# EAGLE board pic32ak_fe (EAGLE 9.6.2)
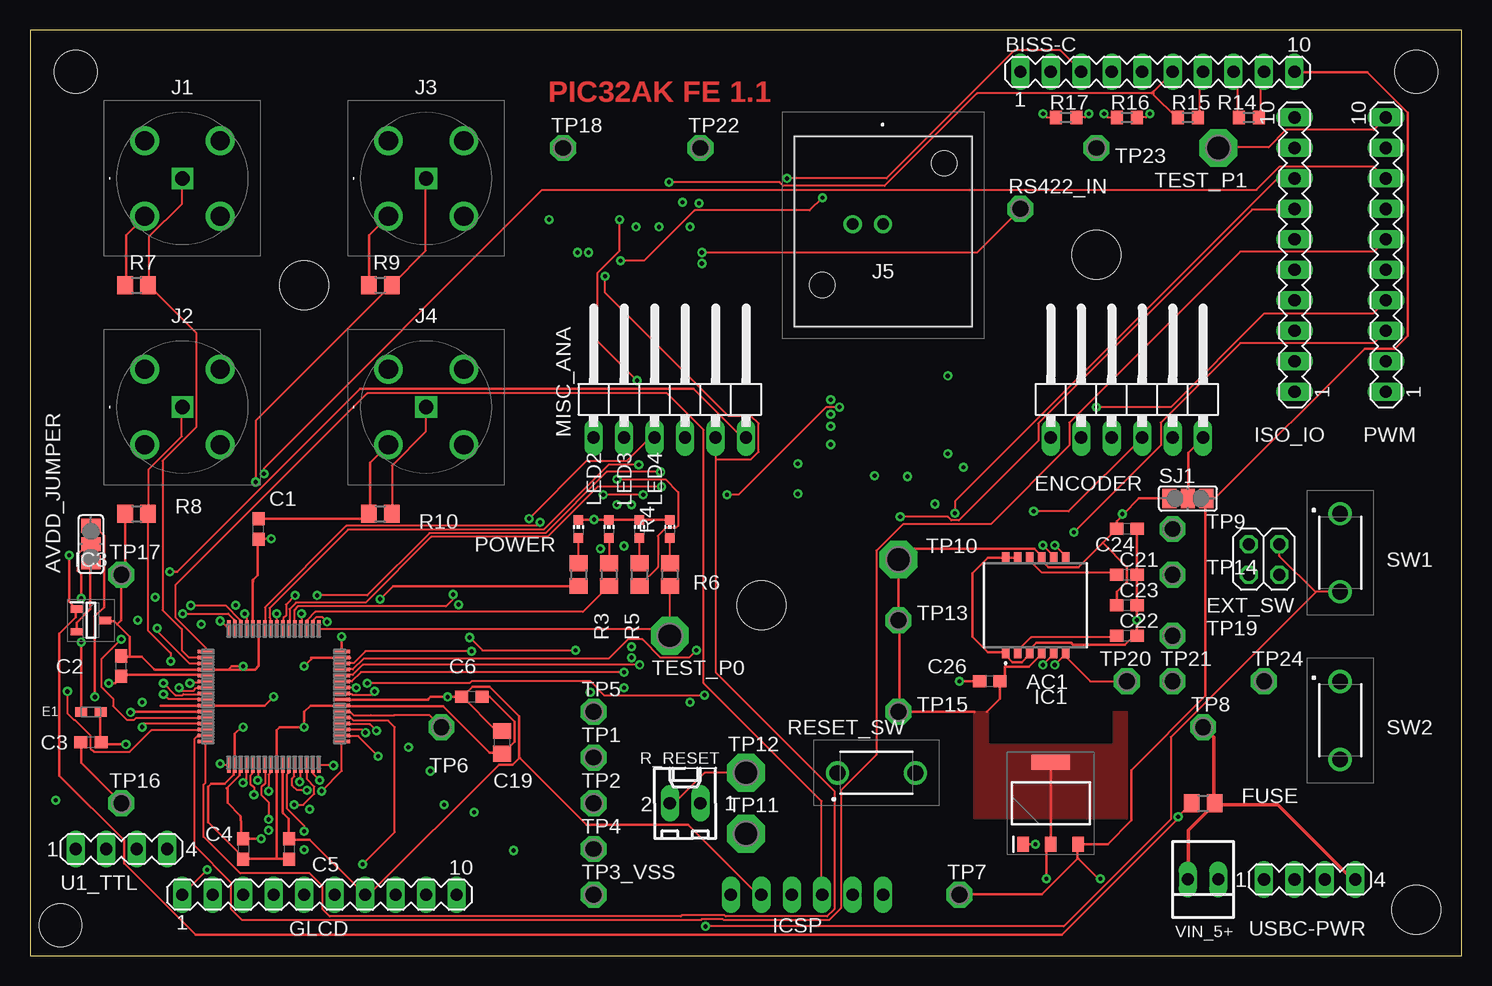
[diagram p1: board, top side]
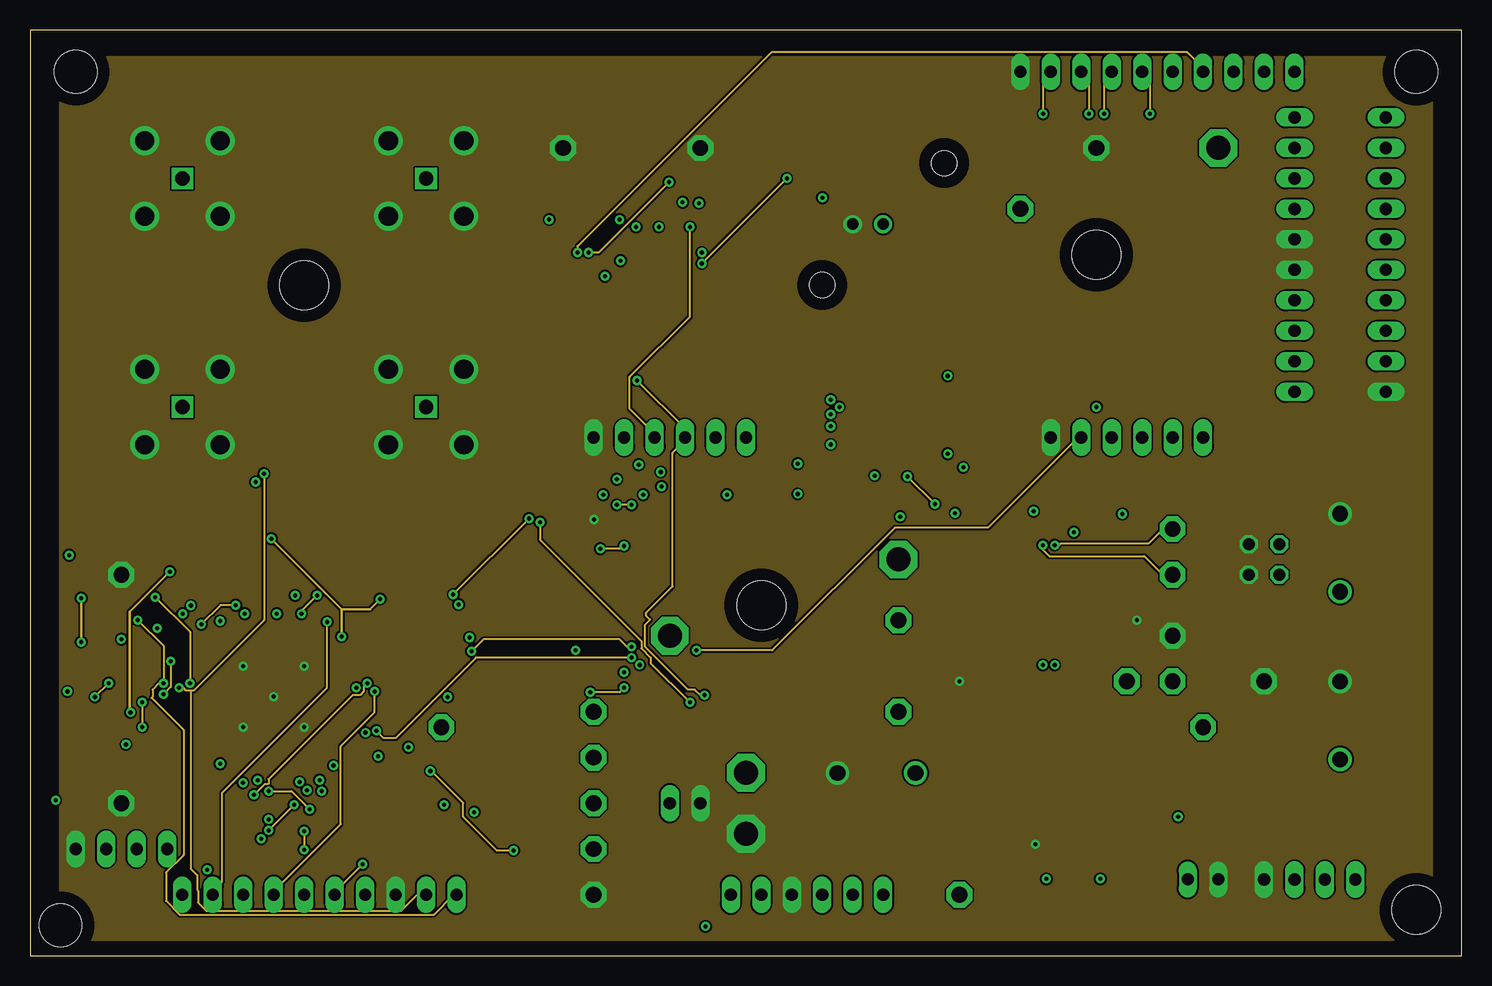
[diagram p2: board, inner layer Route2]
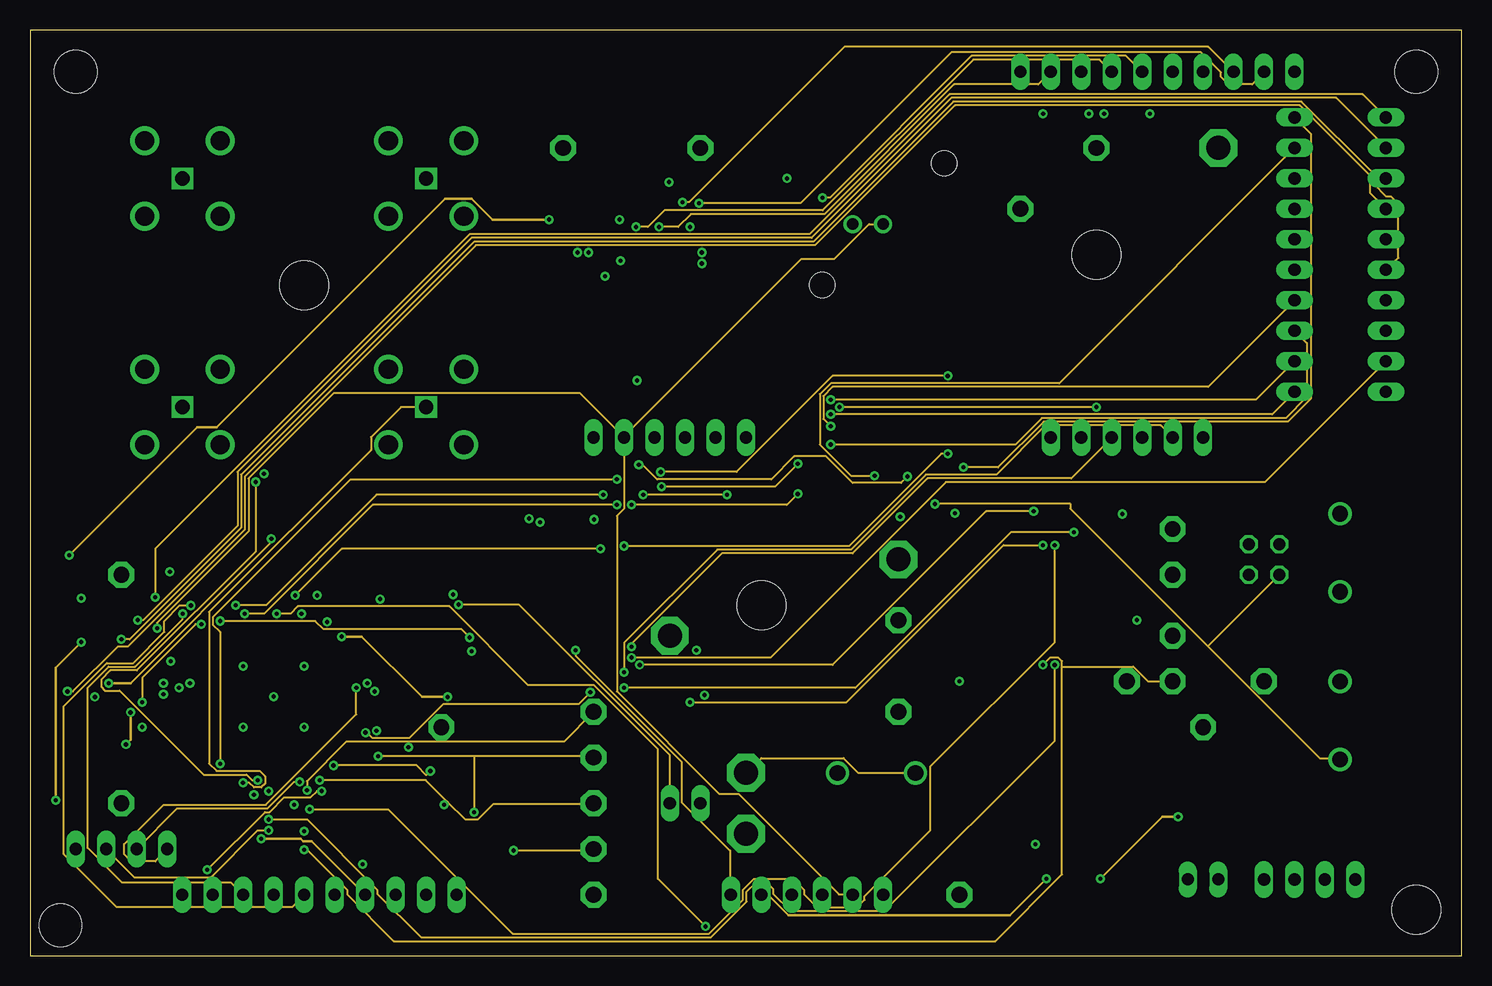
[diagram p3: board, inner layer Route15]
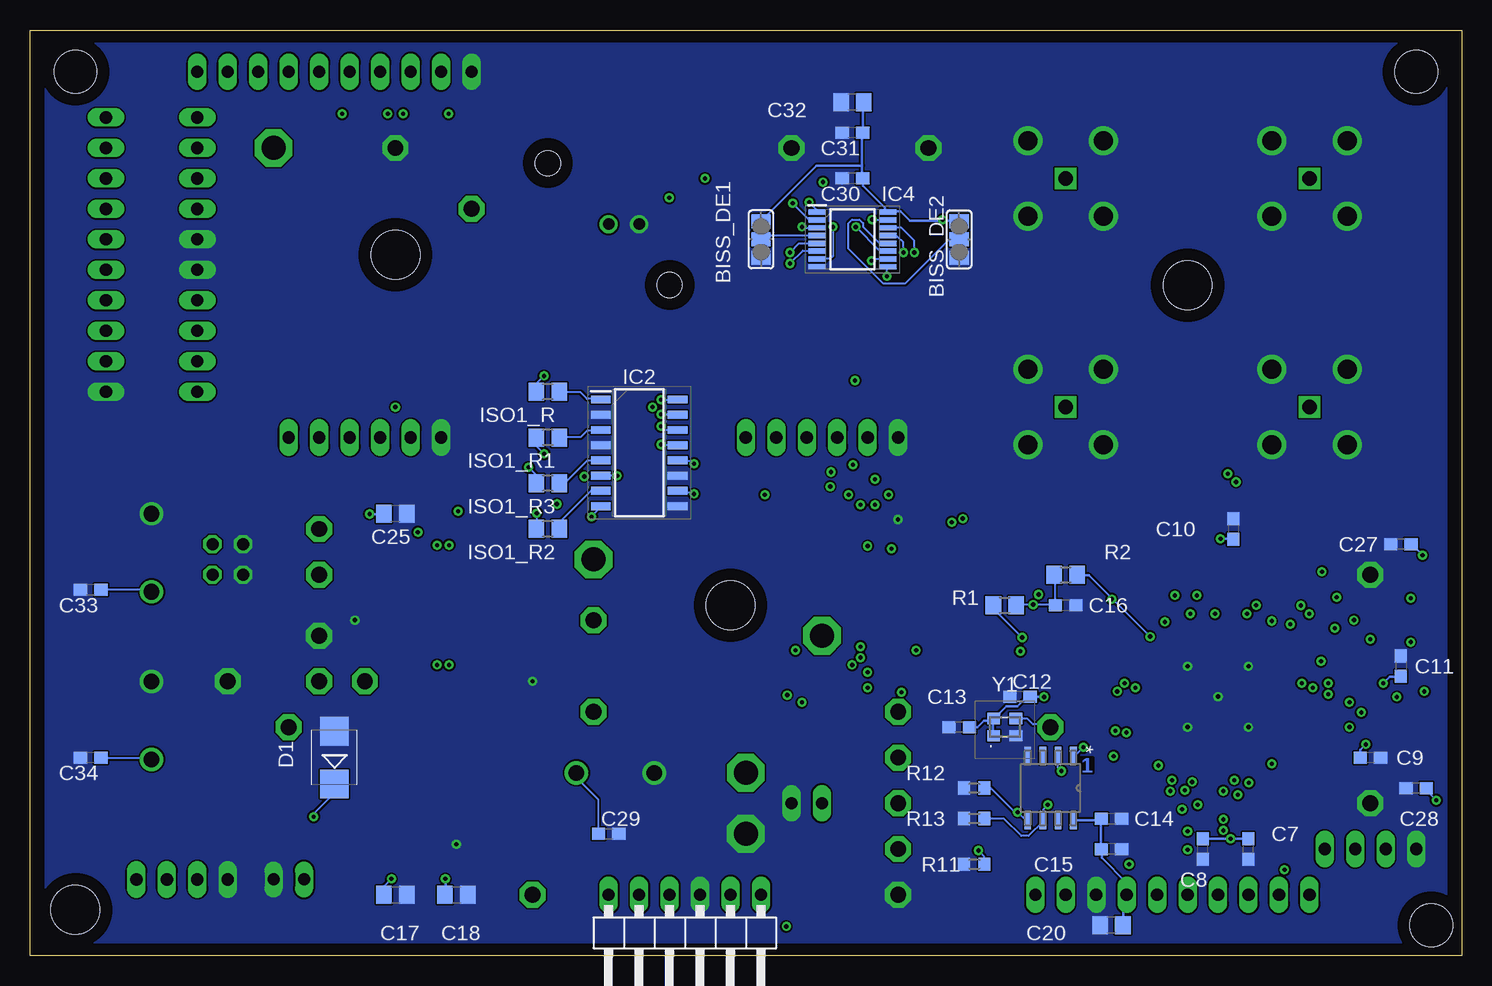
[diagram p4: board, bottom side, seen from below]

Size 119.36 x 77.14 mm. Coordinates in mm from the lower left corner, seen from the top.
Outline: 0,0 119.36,0 119.36,77.14 0,77.14 0,0
Copper layers (1+2*15+16): Top 0.035mm / dielectric 1.5mm / Route2 0.035mm / dielectric 0.15mm / Route15 0.035mm / dielectric 0.2mm / Bottom 0.035mm
Design rules "default *": minimum track width 6mil, minimum drill 0.35mm, track to track 6mil, track to pad 6mil, pad to pad 6mil, via to via 6mil, smd to smd 6mil, copper to edge 40mil, drill to drill 6mil, minimum pad ring 10mil, minimum via ring 8mil, stop-mask expansion 4mil, vias tented up to drill 0mil, thermal gap 10mil
Net classes: 1 current: width 0.203 mm; 2 high_current: width 0.305 mm
Holes 4.06 mm at 22.86,55.88 115.57,3.81 60.96,29.21 88.9,58.42
Holes 3.56 mm at 2.54,2.54 3.81,73.66 115.57,73.66
tRestrict: area 15.2,16.5 to 25.4,26.7; area 78.7,26.7 to 88.9,31.8; area 80,17.8 to 90.2,20.3
vRestrict: area 80,26.7 to 87.6,31.8

## Footprints (pad centres in the part's own frame; a part is rotated, then mirrored left to right if it is on the bottom)
SCA3300 = smd 0.61 x 0.98: 1 -2.5,-3.935; 2 -1.5,-3.935; 3 -0.5,-3.935; 4 0.5,-3.935; 5 1.5,-3.935; 6 2.5,-3.935; 7 2.5,3.935; 8 1.5,3.935; 9 0.5,3.935; 10 -0.5,3.935; 11 -1.5,3.935; 12 -2.5,3.935
SJ_2 = smd 1.168 x 1.6: 1 -1.524,0; 2 0,0; 3 1.524,0
MA10-1 = drill 1.016 long: 1 -11.43,0; 2 -8.89,0; 3 -6.35,0; 4 -3.81,0; 5 -1.27,0; 6 1.27,0; 7 3.81,0; 8 6.35,0; 9 8.89,0; 10 11.43,0
C0603 = smd 1.1 x 1: 1 -0.85,0; 2 0.85,0
C0805 = smd 1.3 x 1.5: 1 -0.95,0; 2 0.95,0
SMB = smd 2.4 x 2.4: A 2.2,0; C -2.2,0
FB_LI0603G121R-10 = smd 1 x 0.8: 1 -0.8,0; 2 0.8,0
1X06/90 = drill 1.016 long: 1 -6.35,-3.81; 2 -3.81,-3.81; 3 -1.27,-3.81; 4 1.27,-3.81; 5 3.81,-3.81; 6 6.35,-3.81
2X02 = drill 1.016 octagon: 1 -1.27,-1.27; 2 -1.27,1.27; 3 1.27,-1.27; 4 1.27,1.27
R0805 = smd 1.3 x 1.5: 1 -0.95,0; 2 0.95,0
SOT230P700X180-4N = smd 1.25 x 0.95: 1 -3.4,2.3; 2 -3.4,0; 3 -3.4,-2.3 | smd 1.25 x 3.2: 4 3.4,0
SOIC127P700X230-16N = smd 1.65 x 0.65: 1 -3.2,4.445; 2 -3.2,3.175; 3 -3.2,1.905; 4 -3.2,0.635; 5 -3.2,-0.635; 6 -3.2,-1.905; 7 -3.2,-3.175; 8 -3.2,-4.445; 9 3.2,-4.445; 10 3.2,-3.175; 11 3.2,-1.905; 12 3.2,-0.635; 13 3.2,0.635; 14 3.2,1.905; 15 3.2,3.175; 16 3.2,4.445
SOT96P237X111-3N = smd 1 x 0.6: 1 -1.2,0.955; 2 -1.2,-0.955; 3 1.2,0
SOP65P640X120-16N = smd 1.475 x 0.45: 1 -2.938,2.275; 2 -2.938,1.625; 3 -2.938,0.975; 4 -2.938,0.325; 5 -2.938,-0.325; 6 -2.938,-0.975; 7 -2.938,-1.625; 8 -2.938,-2.275; 9 2.938,-2.275; 10 2.938,-1.625; 11 2.938,-0.975; 12 2.938,-0.325; 13 2.938,0.325; 14 2.938,0.975; 15 2.938,1.625; 16 2.938,2.275
CONBNC001 = drill 1.2 pad 1.8 square: 1 0,0 | drill 1.6 pad 2.4: 2 -3.15,3.15; 3 -3.15,-3.15; 4 3.15,-3.15; 5 3.15,3.15
52272223 = drill 0.97 pad 1.509: 1 0,0; 2 -2.54,0 | hole 2.09: 5.08,5.08; -5.08,-5.08
CHIP-LED0603 = smd 0.8 x 0.8: A 0,-0.75; C 0,0.75
R0603 = smd 1 x 1.1: 1 -0.85,0; 2 0.85,0
6410-02 = drill 1.016 long: 1 1.27,0; 2 -1.27,0
PTS635SL50LFS = drill 1.3 pad 1.95: 1 0,0; 2 6.5,0
P1-13 = drill 1.321 pad 2.159 octagon: TP 0,0
P1-20 = drill 2.007 pad 3.15 octagon: TP 0,0
TQFP64_PT_MCH = smd 1.346 x 0.279: 1 -5.677,3.75; 2 -5.677,3.25; 3 -5.677,2.75; 4 -5.677,2.25; 5 -5.677,1.75; 6 -5.677,1.25; 7 -5.677,0.75; 8 -5.677,0.25; 9 -5.677,-0.25; 10 -5.677,-0.75; 11 -5.677,-1.25; 12 -5.677,-1.75; 13 -5.677,-2.25; 14 -5.677,-2.75; 15 -5.677,-3.25; 16 -5.677,-3.75; 33 5.677,-3.75; 34 5.677,-3.25; 35 5.677,-2.75; 36 5.677,-2.25; 37 5.677,-1.75; 38 5.677,-1.25; 39 5.677,-0.75; 40 5.677,-0.25; 41 5.677,0.25; 42 5.677,0.75; 43 5.677,1.25; 44 5.677,1.75; 45 5.677,2.25; 46 5.677,2.75; 47 5.677,3.25; 48 5.677,3.75 | smd 0.279 x 1.346: 17 -3.75,-5.677; 18 -3.25,-5.677; 19 -2.75,-5.677; 20 -2.25,-5.677; 21 -1.75,-5.677; 22 -1.25,-5.677; 23 -0.75,-5.677; 24 -0.25,-5.677; 25 0.25,-5.677; 26 0.75,-5.677; 27 1.25,-5.677; 28 1.75,-5.677; 29 2.25,-5.677; 30 2.75,-5.677; 31 3.25,-5.677; 32 3.75,-5.677; 49 3.75,5.677; 50 3.25,5.677; 51 2.75,5.677; 52 2.25,5.677; 53 1.75,5.677; 54 1.25,5.677; 55 0.75,5.677; 56 0.25,5.677; 57 -0.25,5.677; 58 -0.75,5.677; 59 -1.25,5.677; 60 -1.75,5.677; 61 -2.25,5.677; 62 -2.75,5.677; 63 -3.25,5.677; 64 -3.75,5.677
MA04-1 = drill 1.016 long: 1 -3.81,0; 2 -1.27,0; 3 1.27,0; 4 3.81,0
SOIC8_150MIL_N_ISI = smd 1.46 x 0.559: 1 -2.724,1.905; 2 -2.724,0.635; 3 -2.724,-0.635; 4 -2.724,-1.905; 5 2.724,-1.905; 6 2.724,-0.635; 7 2.724,0.635; 8 2.724,1.905
22-23-2021 = drill 1 long: 1 -1.27,0; 2 1.27,0
KC2520Z800000C1KX00 = smd 1.05 x 0.95: 1 -0.925,-0.725; 2 0.925,-0.725; 3 0.925,0.725; 4 -0.925,0.725

## Placement (x,y rotation side)
AC1  SCA3300-D01-1  [SCA3300]  83.82,29.21 0 top
AVDD_JUMPER  AVDD JUMPER  [SJ_2]  5.08,34.29 90 top
BISS-C  BISS-C  [MA10-1]  93.98,73.66 0 top
BISS_DE1  BISS_DE1  [SJ_2]  58.42,59.69 90 bottom
BISS_DE2  BISS_DE2  [SJ_2]  41.91,59.69 270 bottom
C1  1000pf  [C0603]  19.05,35.56 90 top
C2  1000pf  [C0603]  7.62,24.13 90 top
C3  1000pf  [C0603]  5.08,17.78 180 top
C4  1000pf  [C0603]  17.78,8.89 270 top
C5  1000pf  [C0603]  21.59,8.89 270 top
C6  1000pf  [C0603]  36.83,21.59 0 top
C7  0.1uf  [C0603]  17.78,8.89 90 bottom
C8  0.1uf  [C0603]  21.59,8.89 90 bottom
C9  0.1uf  [C0603]  7.62,16.51 180 bottom
C10  0.1uf  [C0603]  19.05,35.56 270 bottom
C11  0.1uf  [C0603]  5.08,24.13 270 bottom
C12  0.1uf  [C0603]  36.83,21.59 0 bottom
C13  0.1uf  [C0603]  41.91,19.05 180 bottom
C14  1000pf  [C0603]  29.21,11.43 0 bottom
C15  0.1uf  [C0603]  29.21,8.89 180 bottom
C16  1000pf  [C0603]  33.02,29.21 0 bottom
C17  10uf  [C0805]  88.9,5.08 0 bottom
C18  10uf  [C0805]  83.82,5.08 0 bottom
C19  10uf  [C0805]  39.37,17.78 90 top
C20  10uf  [C0805]  29.21,2.54 180 bottom
C21  0.1uf  [C0603]  91.44,31.75 0 top
C22  0.1uf  [C0603]  91.44,26.67 0 top
C23  1000pf  [C0603]  91.44,29.21 0 top
C24  0.1uf  [C0603]  91.44,35.56 180 top
C25  10uf  [C0805]  88.9,36.83 180 bottom
C26  0.1uf  [C0603]  80.01,22.86 180 top
C27  0.1uf  [C0603]  5.08,34.29 180 bottom
C28  0.1uf  [C0603]  3.81,13.97 180 bottom
C29  0.1uf  [C0603]  71.12,10.16 0 bottom
C30  0.1uf  [C0603]  50.8,64.77 180 bottom
C31  1000pf  [C0603]  50.8,68.58 180 bottom
C32  10uf  [C0805]  50.8,71.12 180 bottom
C33  0.1uf  [C0603]  114.3,30.48 180 bottom
C34  0.1uf  [C0603]  114.3,16.51 180 bottom
D1  5.6V  [SMB]  93.98,16.51 90 bottom
E1  LI0603G121R-10  [FB_LI0603G121R-10]  5.08,20.32 0 top
ENCODER  Encoder  [1X06/90]  91.44,46.99 0 top
EXT_SW  EXT_SW  [2X02]  102.87,33.02 180 top
FUSE  0 ohm  [R0805]  97.79,12.7 0 top
GLCD  GLCD  [MA10-1]  24.13,5.08 0 top
IC1  NCP1117LPST33T3G  [SOT230P700X180-4N]  85.09,12.7 90 top
IC2  SFH6916  [SOIC127P700X230-16N]  68.58,41.91 0 bottom
IC3  NCP51460SN33T1G  [SOT96P237X111-3N]  5.08,27.94 0 top
IC4  SN65C1168EPWR  [SOP65P640X120-16N]  50.8,59.69 0 bottom
ICSP  ICSP  [1X06/90]  64.77,1.27 180 bottom
ISO1_R  330 ohm  [R0805]  76.2,46.99 180 bottom
ISO1_R1  330 ohm  [R0805]  76.2,43.18 180 bottom
ISO1_R2  2.2k ohm  [R0805]  76.2,35.56 180 bottom
ISO1_R3  2.2k ohm  [R0805]  76.2,39.37 180 bottom
ISO_IO  ISO_IO  [MA10-1]  105.41,58.42 90 top
J1  CONBNC001  [CONBNC001]  12.7,64.77 0 top
J2  CONBNC001  [CONBNC001]  12.7,45.72 0 top
J3  CONBNC001  [CONBNC001]  33.02,64.77 0 top
J4  CONBNC001  [CONBNC001]  33.02,45.72 0 top
J5  5227222-3  [52272223]  71.12,60.96 0 top
LED2  rled  [CHIP-LED0603]  48.26,35.56 0 top
LED3  dled  [CHIP-LED0603]  50.8,35.56 0 top
LED4  hled  [CHIP-LED0603]  53.34,35.56 0 top
MISC_ANA  MISC_ANA  [1X06/90]  53.34,46.99 0 top
POWER  POWER  [CHIP-LED0603]  45.72,35.56 0 top
PWM  PWM  [MA10-1]  113.03,58.42 90 top
R1  56 ohm  [R0805]  38.1,29.21 0 bottom
R2  10K ohm  [R0805]  33.02,31.75 0 bottom
R3  2.2K ohm  [R0805]  45.72,31.75 270 top
R4  2.2K ohm  [R0805]  48.26,31.75 270 top
R5  2.2K ohm  [R0805]  50.8,31.75 270 top
R6  2.2K ohm  [R0805]  53.34,31.75 270 top
R7  50 ohm  [R0805]  8.89,55.88 0 top
R8  50 ohm  [R0805]  8.89,36.83 0 top
R9  50 ohm  [R0805]  29.21,55.88 0 top
R10  50 ohm  [R0805]  29.21,36.83 0 top
R11  120 ohm  [R0603]  40.64,7.62 0 bottom
R12  50 ohm  [R0603]  40.64,13.97 0 bottom
R13  50 ohm  [R0603]  40.64,11.43 0 bottom
R14  120 ohm  [R0603]  101.6,69.85 180 top
R15  120 ohm  [R0603]  96.52,69.85 180 top
R16  120 ohm  [R0603]  91.44,69.85 180 top
R17  120 ohm  [R0603]  86.36,69.85 180 top
R_RESET  22-27-2021-02  [6410-02]  54.61,12.7 0 top
RESET_SW  PTS635SL50LFS  [PTS635SL50LFS]  67.31,15.24 0 top
RS422_IN  PTR1PAD1-13  [P1-13]  82.55,62.23 0 top
SJ1  QEI Voltage  [SJ_2]  96.52,38.1 0 top
SW1  PTS635SL50LFS  [PTS635SL50LFS]  109.22,36.83 270 top
SW2  PTS635SL50LFS  [PTS635SL50LFS]  109.22,22.86 270 top
TEST_P0  PTR1PAD1-20  [P1-20]  53.34,26.67 0 top
TEST_P1  PTR1PAD1-20  [P1-20]  99.06,67.31 0 top
TP1  PTR1PAD1-13  [P1-13]  46.99,16.51 0 top
TP2  PTR1PAD1-13  [P1-13]  46.99,12.7 0 top
TP3_VSS  PTR1PAD1-13  [P1-13]  46.99,5.08 0 top
TP4  PTR1PAD1-13  [P1-13]  46.99,8.89 0 top
TP5  PTR1PAD1-13  [P1-13]  46.99,20.32 0 top
TP6  PTR1PAD1-13  [P1-13]  34.29,19.05 0 top
TP7  PTR1PAD1-13  [P1-13]  77.47,5.08 0 top
TP8  PTR1PAD1-13  [P1-13]  97.79,19.05 0 top
TP9  PTR1PAD1-13  [P1-13]  95.25,35.56 0 top
TP10  PTR1PAD1-20  [P1-20]  72.39,33.02 0 top
TP11  PTR1PAD1-20  [P1-20]  59.69,10.16 0 top
TP12  PTR1PAD1-20  [P1-20]  59.69,15.24 0 top
TP13  PTR1PAD1-13  [P1-13]  72.39,27.94 0 top
TP14  PTR1PAD1-13  [P1-13]  95.25,31.75 0 top
TP15  PTR1PAD1-13  [P1-13]  72.39,20.32 0 top
TP16  PTR1PAD1-13  [P1-13]  7.62,12.7 0 top
TP17  PTR1PAD1-13  [P1-13]  7.62,31.75 0 top
TP18  PTR1PAD1-13  [P1-13]  44.45,67.31 0 top
TP19  PTR1PAD1-13  [P1-13]  95.25,26.67 0 top
TP20  PTR1PAD1-13  [P1-13]  91.44,22.86 0 top
TP21  PTR1PAD1-13  [P1-13]  95.25,22.86 0 top
TP22  PTR1PAD1-13  [P1-13]  55.88,67.31 0 top
TP23  PTR1PAD1-13  [P1-13]  88.9,67.31 0 top
TP24  PTR1PAD1-13  [P1-13]  102.87,22.86 0 top
U1  PIC32AK1216GC41064-E/PT  [TQFP64_PT_MCH]  20.32,21.59 0 top
U1_TTL  U1_TTL  [MA04-1]  7.62,8.89 0 top
U2  IS66WVS4M8BLL-104NLI  [SOIC8_150MIL_N_ISI]  34.29,13.97 270 bottom
USBC-PWR  USBC-PWR  [MA04-1]  106.68,6.35 0 top
VIN_5+  22-23-2021  [22-23-2021]  97.79,6.35 180 top
Y1  KC2520Z8.00000C1KX00  [KC2520Z800000C1KX00]  38.1,19.05 0 bottom

## Tracks (layer width: path | path; a pad name or v marks a point on that pad's centre or on a via)
3.3REG
  Top 0.203: IC3.2 3.89,27.05 3.89,27.74 5.03,28.88 5.03,32.77 AVDD_JUMPER.1
8MHZ_CLK
  Top 0.152: U1.38 26.06,20.27 26.75,20.27 26.84,20.17 26.94,20.08 26.98,20.04 28.42,20.04 30.32,20.04 30.4,20.04 33.3,20.04 TP6.TP
  Bottom 0.152: TP6.TP 34.52,19.28 35.74,19.28 36.2,19.74 37.11,19.74 Y1.3
AD1AN6
  Top 0.152: U1.2 13.26,24.84 12.7,25.4 12.65,25.45 12.65,27.2 11.05,28.8 11.05,41.22 13.87,44.04 13.87,51.89 9.91,55.85 R7.2 9.91,55.93 9.91,59.89 12.65,62.64 12.65,64.77 J1.1
AD2AN7  (via drill 0.35)
  Top 0.152: v11.12,21.79 11.51,21.41 14.63,21.41 U1.9 | v11.73,24.54 11.73,25.22 9.83,27.13 9.83,36.8 R8.2 9.91,36.88 9.91,40.54 12.65,43.28 12.65,45.72 J2.1
  Route2 0.152: v11.12,21.79 11.73,22.4 v11.73,24.54
AVDD  (via drill 0.35)
  Top 0.203: 14.62,20.32 14.61,20.32 | 14.61,20.32 13.34,20.32 9.6,20.32 9.37,20.32 8.69,20.32 8.42,20.32 v8.38,20.27 | E1.2 5.87,20.27 5.87,17.83 C3.1 6.02,17.75 6.17,17.6 v8,17.6 | v11.66,32 12.27,32 27.51,47.24 55.32,47.24 59.36,43.2 59.66,43.2 MISC_ANA.6 | U1.11 14.61,20.32
  Route2 0.203: v11.66,32 8.31,28.65 8.31,20.34 v8.38,20.27
  Route15 0.203: v8.38,20.27 8.38,17.98 v8,17.6
  Bottom 0.203: v8,17.6 8.46,17.14 8.46,16.54 C9.2
AVDD_IN  (via drill 0.35)
  Top 0.203: v4.27,26.14 4.27,20.34 E1.1 | v4.27,29.79 4.27,31.77 3.96,32.08 3.96,33.45 4.8,34.29 AVDD_JUMPER.2
  Route2 0.203: v4.27,29.79 v4.27,26.14
  Route15 0.203: v2.13,12.95 2.13,24 v4.27,26.14
  Bottom 0.203: v2.13,12.95 2.9,13.72 2.9,13.95 C28.1
DIS_CS  (via drill 0.35)
  Top 0.152: v13.41,29.18 16.31,29.18 17.53,27.96 17.53,27.28 U1.62
  Route15 0.152: v13.41,29.18 12.5,29.18 11.2,27.89 11.2,26.98 8.61,24.38 6.4,24.38 2.82,20.8 2.82,8.46 7.24,4.04 21.87,4.04 22.86,5.03 GLCD.5
DIS_MODE  (via drill 0.35)
  Top 0.152: v28.73,22.02 28.42,21.72 26.9,21.72 26.82,21.79 26.06,21.79 U1.41
  Route2 0.152: v28.73,22.02 28.73,20.27 25.91,17.45 25.91,10.97 20.34,5.41 20.34,5.11 GLCD.4
DIS_RESET  (via drill 0.35)
  Top 0.152: v27.74,7.62 30.4,10.29 30.4,19.05 29.87,19.58 26.98,19.58 26.75,19.81 26.06,19.81 U1.37
  Route2 0.152: v27.74,7.62 25.45,5.33 25.45,5.11 GLCD.6
DLED  (via drill 0.35)
  Top 0.152: v15.85,16 15.93,15.93 16.54,15.93 U1.17 | v48.92,39.7 52.96,39.7 54.03,38.63 54.03,35.81 53.87,35.66 53.03,35.66 52.35,34.98 52.35,32.38 50.83,30.86 R5.2
  Route15 0.152: v15.85,16 15.85,26.98 15.24,27.58 15.24,28.19 26.75,39.7 v48.92,39.7
HLED
  Top 0.152: U1.49 24.08,27.2 52.81,27.2 TEST_P0.TP 52.88,27.2 53.34,27.66 R6.2
IMU_CS  (via drill 0.35)
  Top 0.152: v84.43,24.23 85.27,25.07 85.27,25.22 AC1.5 | v22.86,10.36 22.86,10.82 21.41,12.27 21.41,15.09 21.57,15.24 21.57,15.85 U1.27
  Route2 0.152: v22.86,10.36 v22.86,8.84
  Route15 0.152: v84.43,24.23 85.04,24.84 85.72,24.84 86.03,24.54 86.03,24.08 | 86.03,24.08 86.03,6.78 80.47,1.22 30.33,1.22 26.44,5.11 26.44,5.49 23.09,8.84 v22.86,8.84 | TP21.TP 93.19,22.86 91.97,24.08 86.03,24.08
IOS1_N  (via drill 0.35)
  Route15 0.152: v66.75,45.11 103.56,45.11 105.39,46.94 ISO_IO.1
  Bottom 0.152: v66.75,45.11 65.46,45.11 IC2.15
IOS1_P  (via drill 0.35)
  Route15 0.152: v66.75,46.33 102.18,46.33 105.39,49.53 ISO_IO.2
  Bottom 0.152: v66.75,46.33 65.46,46.33 IC2.16
IOS2_N  (via drill 0.35)
  Route15 0.152: v66.75,42.6 82.14,42.6 84.35,44.81 104.7,44.81 106.45,46.56 106.45,51.05 105.46,52.05 ISO_IO.3
  Bottom 0.152: v66.75,42.6 65.46,42.6 IC2.13
IOS3_O  (via drill 0.35)
  Top 0.152: v52.65,39.09 47.32,39.09 43.13,34.9 33.45,34.9 27.96,29.41 22.17,29.41 21.64,28.88 21.64,27.28 U1.54
  Route15 0.152: v52.65,39.09 62.1,39.09 v64.01,41
  Bottom 0.152: v64.01,41 64.24,41.22 65.38,41.22 IC2.12
IOS3_P  (via drill 0.35)
  Route15 0.152: v77.8,40.69 80.7,40.69 84.51,44.5 104.85,44.5 106.76,46.41 106.76,68.5 ISO_IO.10
  Bottom 0.152: v77.8,40.69 77.19,40.08 77.19,39.4 ISO1_R3.2
IOS4_O  (via drill 0.35)
  Top 0.152: v17.91,28.5 18.06,28.35 U1.61
  Route2 0.152: v50.14,37.57 v48.92,37.57
  Route15 0.152: v17.91,28.5 19.51,28.5 28.57,37.57 v48.92,37.57 | v50.14,37.57 63.09,37.57 v64.01,38.48
  Bottom 0.152: v64.01,38.48 64.16,38.63 65.3,38.63 65.38,38.71 IC2.10
ISO1_S  (via drill 0.35)
  Top 0.152: v22.63,28.5 22.63,27.28 U1.52 | v23.93,30.02 28.12,30.02 33.3,35.2 42.98,35.2 48.08,40.31 v52.58,40.31
  Route2 0.152: v22.63,28.5 22.63,28.73 v23.93,30.02
  Route15 0.152: v52.58,40.31 58.9,40.31 66.9,48.31 v76.5,48.31
  Bottom 0.152: v76.5,48.31 77.11,47.7 77.11,47.02 ISO1_R.2
ISO2_P  (via drill 0.35)
  Route15 0.152: v66.75,44.12 66.14,44.73 66.14,46.63 66.9,47.4 98.22,47.4 105.39,54.56 ISO_IO.4
  Bottom 0.152: IC2.14 66.45,43.81 v66.75,44.12
ISO2_S  (via drill 0.35)
  Top 0.152: v22.1,30.02 21.34,29.26 21.34,28.35 21.11,28.12 21.11,27.28 U1.55
  Route2 0.152: v47.55,33.91 49.3,33.91 v49.53,34.14
  Route15 0.152: v22.1,30.02 25.98,33.91 v47.55,33.91 | v49.53,34.14 68.28,34.14 75.97,41.83 v76.5,41.83
  Bottom 0.152: v76.5,41.83 77.11,42.44 77.11,43.13 ISO1_R1.2
ISO3_N  (via drill 0.35)
  Route15 0.152: v70.41,40.01 68.43,40.01 65.84,42.6 65.84,46.79 66.75,47.7 85.8,47.7 ISO_IO.9
  Bottom 0.152: v70.41,40.01 IC2.6
ISO4_N  (via drill 0.35)
  Top 0.152: v72.54,36.58 76.5,36.58 76.81,36.27 77.42,36.27 84.05,42.9 84.05,44.35 101.88,62.18 105.39,62.18 ISO_IO.7
  Bottom 0.152: v72.54,36.58 72.39,36.73 72.39,36.8 71.78,37.41 IC2.8
ISO4_P  (via drill 0.35)
  Top 0.152: v77.11,36.88 77.11,37.87 104.01,64.77 ISO_IO.8
  Bottom 0.152: v77.11,36.88 77.11,35.59 ISO1_R2.2
MA+  (via drill 0.35)
  Top 0.152: v53.26,64.47 62.48,64.47 62.79,64.16 71.25,64.16 78.94,71.86 93.5,71.86 93.69,72.05 | 93.69,72.05 95.25,73.61 BISS-C.6 | R15.2 95.57,69.85 93.66,71.75 93.66,72.07 93.69,72.05
  Route2 0.152: v46.56,58.6 47.4,58.6 v53.26,64.47
  Bottom 0.152: v46.56,58.6 46.56,59.44 47.09,59.97 47.85,59.97 IC4.13
MA-  (via drill 0.35)
  Top 0.152: BISS-C.7 97.47,73.34 97.47,69.85 R15.1
  Route2 0.152: v45.64,58.6 45.64,59.13 61.8,75.29 96.47,75.29 97.77,73.99 97.77,73.69 BISS-C.7
  Bottom 0.152: v45.64,58.6 45.64,59.59 46.71,60.66 IC4.14
MCLR  (via drill 0.35)
  Top 0.152: v15.85,27.89 15.93,27.89 16.54,27.28 U1.64 | v45.49,25.45 37.72,25.45 v36.65,26.52
  Route15 0.152: v15.85,27.89 23.77,27.89 24.46,27.2 35.97,27.2 v36.65,26.52 | v45.49,25.45 45.49,24.99 54.33,16.15 54.33,12.8 58.37,8.76 58.37,5.11 ICSP.1
  Bottom 0.152: v36.65,26.52 39.01,28.88 39.01,29.18 R1.1
MO+  (via drill 0.35)
  Top 0.152: R16.2 89.85,69.85 v89.53,70.17
  Route2 0.152: v89.53,70.17 89.53,72.71 90.17,73.34 BISS-C.4
  Route15 0.152: v50.52,60.73 51.51,60.73 52.88,62.1 66.06,62.1 78.64,74.68 89.15,74.68 BISS-C.4
  Bottom 0.152: v50.52,60.73 48.54,58.75 47.93,58.75 IC4.11
MO-  (via drill 0.35)
  Top 0.152: v49.23,57.91 51.21,57.91 55.4,62.1 65,62.1 v66.06,63.17 | R16.1 93.03,69.85 v93.34,70.17
  Route2 0.152: v93.34,70.17 93.34,72.71 92.71,73.34 BISS-C.5
  Route15 0.152: v66.06,63.17 66.67,63.17 78.49,74.98 91.36,74.98 92.66,73.69 BISS-C.5
  Bottom 0.152: v49.23,57.91 49.07,58.06 47.93,58.06 IC4.10
N$1
  Top 0.152: AC1.2 82.37,25.3 82.37,25.45 83.44,26.52 90.37,26.52 90.53,26.67 C22.1
N$2
  Top 0.152: R3.1 POWER.A
N$3
  Top 0.152: 48.31,34.44 48.31,34.75 LED2.A 48.31,34.44 | 48.31,34.44 48.31,32.77 R4.1
N$4
  Top 0.152: LED3.A 50.83,34.75 50.83,32.77 R5.1
N$5
  Top 0.152: R6.1 LED4.A
N$6
  Top 0.152: AC1.10 83.36,33.07 83.36,32.92 84.35,31.93 90.37,31.93 90.53,31.77 C21.1
N$7
  Bottom 0.152: ISO1_R.1 75.21,46.94 73.46,46.94 72.92,46.41 71.78,46.41 IC2.1
N$8
  Bottom 0.152: IC2.3 71.86,43.74 72.92,43.74 73.46,43.2 75.21,43.2 ISO1_R1.1 | IC2.3
N$9
  Bottom 0.152: ISO1_R3.1 75.21,39.4 74.75,39.4 72.92,41.22 71.78,41.22 IC2.5
N$10
  Bottom 0.152: ISO1_R2.1 75.21,35.59 75.21,36.12 72.54,38.79 71.78,38.79 IC2.7
N$11
  Bottom 0.152: BISS_DE1.2 58.06,60.05 53.8,60.05 IC4.4
N$12
  Bottom 0.152: IC4.12 47.93,59.44 48.62,59.44 49.91,60.73 49.91,61.04 50.22,61.34 50.83,61.34 51.13,61.04 51.13,58.9 48.23,56.01 46.41,56.01 42.67,59.74 41.91,59.74 BISS_DE2.2
N$19  (via drill 0.35)
  Top 0.152: v56.01,58.6 78.94,58.6 82.53,62.18 RS422_IN.TP
  Bottom 0.152: v56.01,58.6 55.24,59.36 53.8,59.36 IC4.5
OA2IN  (via drill 0.35)
  Top 0.152: v18.97,14.63 19.05,14.71 19.05,15.85 U1.22 | v18.82,39.47 18.82,44.58 30.1,55.85 R9.2 30.18,55.93 32.99,58.75 32.99,64.77 J3.1
  Route15 0.152: v18.97,14.63 18.52,14.63 18.06,15.09 14.48,15.09 7.47,22.1 6.25,22.1 5.94,22.4 5.94,23.01 6.71,23.77 8.91,23.77 18.82,33.68 v18.82,39.47
OA2OUT  (via drill 0.35)
  Top 0.152: v17.75,14.4 18.06,14.71 18.06,15.85 U1.20 | R10.2 30.18,36.88 30.18,40.84 32.99,43.66 32.99,45.72 J4.1
  Route15 0.152: v17.75,14.4 18.29,14.4 18.67,14.02 19.28,14.02 19.58,14.33 19.58,14.94 19.13,15.39 15.54,15.39 14.94,16 14.94,28.65 28.42,42.14 28.42,43.2 30.94,45.72 J4.1
PGC_DAC  (via drill 0.35)
  Top 0.152: v10.59,27.28 10.59,27.05 13.26,24.38 14.63,24.38 U1.3
  Route15 0.152: v10.59,27.28 10.59,27.74 18.21,35.36 18.21,39.78 25.3,46.86 45.87,46.86 49.53,43.2 MISC_ANA.2 | J5.1 69.95,60.96 67.06,58.06 64.31,58.06 49.53,43.28 MISC_ANA.2 | MISC_ANA.2 49.53,37.26 48.92,36.65 48.92,22.02 57.45,13.49 59.05,13.49 67.44,5.11 68.58,5.11 ICSP.5
PGD
  Top 0.152: U1.1 14.63,25.38 14.63,25.68 12.12,28.19 12.12,30.86 28.12,46.86 53.11,46.86 56.16,43.81 56.16,22.71 65.99,12.88 65.99,5.11 ICSP.4
PWM1H  (via drill 0.35)
  Top 0.152: v11.12,22.71 12.12,21.72 12.72,21.72 12.8,21.79 14.63,21.79 U1.8
  Route2 0.152: 11.12,22.78 11.12,25.83 v8.99,27.96 | 11.12,22.78 10.82,22.78 10.21,22.17 10.21,21.57 10.13,21.49 12.8,18.82 12.8,8.38 11.35,6.93 11.35,4.57 12.5,3.43 33.68,3.43 35.28,5.03 35.51,5.03 GLCD.10 | 11.12,22.78 v11.12,22.71
  Route15 0.152: v8.99,27.96 9.45,27.96 17.3,35.81 17.3,40.31 36.8,59.82 65.15,59.82 76.81,71.48 108.89,71.48 113,67.36 PWM.9
PWM1L  (via drill 0.35)
  Top 0.152: v12.42,22.33 12.65,22.1 13.64,22.1 13.87,22.33 14.63,22.33 U1.7 | PWM.8 113,64.77 112.01,65.76 104.17,65.76 102.26,63.86 102.23,63.82 42.7,63.82 19.53,40.64 19.53,40.48 v19.51,40.16
  Route2 0.152: v12.42,22.33 12.8,22.33 13.03,22.1 13.41,22.1 | 13.41,22.1 13.64,22.1 19.51,27.96 v19.51,40.16 | 13.41,22.1 13.41,7.24 13.95,6.71 13.95,5.49 14.02,5.41 14.02,4.42 14.71,3.73 30.94,3.73 32.23,5.03 32.99,5.03 GLCD.9
PWM2H  (via drill 0.35)
  Top 0.152: v7.62,26.36 5.94,24.69 5.94,22.4 6.93,21.41 6.93,20.8 8.08,19.66 8.69,19.66 8.84,19.81 14.63,19.81 U1.12
  Route15 0.152: v7.62,26.36 8.31,26.36 17.6,35.66 17.6,40.08 37.03,59.51 65.3,59.51 76.96,71.17 105.99,71.17 112.01,65.15 112.01,64.31 113.08,63.25 113.46,63.25 114.07,62.64 114.07,58.14 113.08,57.15 PWM.5
PWM2L  (via drill 0.35)
  Top 0.152: U1.13 14.63,19.36 9.37,19.36 v9.37,19.05 | v51.12,38.42 v47.78,38.42 | v58.1,38.42 59.05,38.42 66.36,45.72 v67.47,45.72 | v88.9,45.72 95.09,45.72 102.87,53.5 111.92,53.5 PWM.4
  Route2 0.152: v9.37,21.11 v9.37,19.05 | v14.29,27.62 15.88,29.21 v17.14,29.21
  Route15 0.152: v9.37,21.11 9.37,23.18 13.81,27.62 v14.29,27.62 | v17.14,29.21 19.68,29.21 28.89,38.42 v47.78,38.42 | v58.1,38.42 v51.12,38.42 | v88.9,45.72 v67.47,45.72
PWM3H  (via drill 0.35)
  Top 0.152: v3.12,22.02 3.12,20.19 3.66,19.66 3.73,19.66 5.03,18.36 5.03,17.3 5.33,16.99 8.31,16.99 10.13,18.82 14.63,18.82 U1.14
  Route15 0.152: v3.12,22.02 3.58,22.02 7.32,25.76 8.15,25.76 17.91,35.51 17.91,39.93 37.19,59.21 65.46,59.21 77.11,70.87 105.84,70.87 111.71,65 111.71,63.55 PWM.7
PWM3L
  Top 0.152: PWM.6 112.01,58.67 100.89,58.67 86.64,44.42 86.64,42.52 80.09,35.97 72.77,35.97 70.56,33.76 70.56,16.76 67.59,13.79 67.59,3.96 66.6,2.97 57.84,2.97 57.76,3.05 56.01,3.05 55.93,2.97 17.68,2.97 16.76,3.89 16.76,6.1 13.72,9.14 13.72,18.06 13.95,18.29 14.63,18.29 U1.15
QEI_A  (via drill 0.35)
  Top 0.152: v55.55,25.45 54.94,24.84 52.58,24.84 51.05,26.36 49.84,26.36 48.23,24.77 27.81,24.77 26.9,23.85 26.06,23.85 U1.45
  Route2 0.152: v55.55,25.45 61.87,25.45 72.08,35.66 79.86,35.66 87.33,43.13 87.63,43.13 ENCODER.2
QEI_B  (via drill 0.35)
  Top 0.152: v36.8,25.38 27.96,25.38 26.98,24.38 26.06,24.38 U1.46
  Route2 0.152: v36.8,25.38 37.8,26.36 49.15,26.36 49.84,25.68 50.06,25.68 v50.14,25.76
  Route15 0.152: v50.14,25.76 50.14,25.98 57.68,33.53 68.58,33.53 74.83,39.78 86.79,39.78 90.14,43.13 ENCODER.3
QEI_H  (via drill 0.35)
  Top 0.152: v49.53,23.62 27.58,23.62 26.82,22.86 26.06,22.86 U1.43
  Route15 0.152: v49.53,23.62 49.53,26.06 57.3,33.83 68.43,33.83 74.68,40.08 80.54,40.08 84.66,44.2 94.26,44.2 95.25,43.2 ENCODER.5
QEI_I  (via drill 0.35)
  Top 0.152: v83.67,37.03 86.56,37.03 ENCODER.4 | v50.83,24.23 27.74,24.23 26.9,23.39 26.14,23.39 U1.44
  Route15 0.152: v50.83,24.23 66.9,24.23 79.7,37.03 v83.67,37.03
QEI_PWR
  Top 0.203: SJ1.2 96.55,38.1 96.55,41.91 97.77,43.13 ENCODER.6
RA6  (via drill 0.35)
  Top 0.152: MISC_ANA.5 57.15,41.38 | 57.15,41.38 57.15,23.62 67.06,13.72 67.06,3.89 66.45,3.28 57.99,3.28 57.91,3.35 54.33,3.35 54.25,3.28 24.99,3.28 24.38,3.89 24.38,5.79 23.32,6.86 17.53,6.86 14.48,9.91 14.48,14.25 14.63,14.4 U1.16 | v47.93,56.62 47.93,55.24 58.22,44.96 60.12,44.96 60.73,44.35 60.73,41.99 60.12,41.38 57.15,41.38
  Bottom 0.152: v47.93,56.62 47.93,57.38 IC4.9
RB1  (via drill 0.35)
  Top 0.152: v56.24,21.72 47.85,21.72 46.67,22.9 46.63,22.86 36.8,22.86 36.65,22.71 v28.12,22.71 | v18.67,13.41 18.67,14.02 18.36,14.33 18.36,15.01 18.52,15.16 18.52,15.85 U1.21 | v49.15,61.34 49.15,58.75 47.32,56.92 47.32,51.21 v50.6,47.93
  Route2 0.152: v18.67,13.41 19.58,14.33 19.89,14.33 19.89,14.71 26.9,21.72 27.51,21.72 27.81,22.02 27.81,22.4 v28.12,22.71 | v56.24,21.72 56.16,21.64 55.93,21.64 55.4,22.17 54.86,22.17 51.28,25.76 51.28,27.58 51.7,28 51.36,28.35 51.36,28.57 53.57,30.79 53.57,41.91 54.56,42.9 54.56,43.13 MISC_ANA.4 54.63,43.2 54.63,43.89 v50.6,47.93
  Bottom 0.152: v49.15,61.34 47.93,61.34 IC4.15
RC6  (via drill 0.35)
  Top 0.152: v27.96,18.59 27.74,18.82 26.06,18.82 U1.35 | v87.02,35.28 94.26,42.52 94.26,44.42 100.89,51.05 112.01,51.05 PWM.3
  Route2 0.152: v46.71,21.95 49.15,21.95 v49.53,22.33
  Route15 0.152: v27.96,18.59 28.12,18.59 28.57,18.14 31.62,18.14 34.44,20.95 45.72,20.95 v46.71,21.95 | v49.53,22.33 68.81,22.33 81.76,35.28 v87.02,35.28
RC7  (via drill 0.35)
  Top 0.152: v28.88,18.75 28.35,19.28 26.06,19.28 U1.36
  Route2 0.152: v28.88,18.75 29.49,18.14 30.48,18.14 37.19,24.84 v50.14,24.84
  Route15 0.152: v50.14,24.84 61.72,24.84 76.35,39.47 102.95,39.47 113,49.53 PWM.2
RD2  (via drill 0.35)
  Top 0.152: U1.53 22.02,27.28 22.02,28.8 22.33,29.11 34.67,29.11 35.32,29.76 35.28,29.79 v35.28,30.1 | v41.6,36.42 46.41,41.22 49.76,41.22 51.66,43.13 52.05,43.13 MISC_ANA.3
  Route2 0.152: v35.28,30.1 v41.6,36.42 | v55.02,60.73 55.02,53.26 49.99,48.23 49.99,45.57 52.05,43.51 52.05,43.2 MISC_ANA.3
  Bottom 0.152: v55.02,60.73 54.94,60.66 53.8,60.66 IC4.3
RESET_SW  (via drill 0.35)
  Top 0.152: TP12.TP 56.24,15.24 53.72,12.72 53.34,12.72 R_RESET.2
  Route15 0.152: v35.74,29.26 40.77,29.26 53.34,16.69 R_RESET.2 | RESET_SW.2 69.04,15.24 67.82,16.46 60.96,16.46 59.74,15.24 TP12.TP
  Bottom 0.152: R2.1 33.91,31.7 33.91,29.26 C16.1 33.98,29.26 v35.74,29.26 37.11,29.26 R1.2 | C29.1 72.01,10.21 72.01,13.03 73.76,14.78 73.76,15.24 RESET_SW.2
RLED
  Top 0.152: U1.51 23.09,27.28 23.09,27.96 23.77,28.65 46.1,28.65 48.23,30.79 R4.2
RS422_I+  (via drill 0.35)
  Top 0.152: R17.2 84.77,69.85 v84.45,70.17
  Route2 0.152: v84.45,70.17 84.45,72.71 85.09,73.34 BISS-C.2
  Route15 0.152: v52.43,60.73 54.03,60.73 55.09,61.8 66.22,61.8 77.04,72.62 84.05,72.62 BISS-C.2
  Bottom 0.152: v52.43,60.73 52.43,58.29 52.65,58.06 53.72,58.06 IC4.7
RS422_I-  (via drill 0.35)
  Top 0.152: v63.09,64.77 71.4,64.77 82.07,75.44 85.88,75.44 87.63,73.69 BISS-C.3 | R17.1 87.95,69.85 v88.27,70.17
  Route2 0.152: v63.09,64.77 v56.01,57.68 | v88.27,70.17 88.27,72.71 87.63,73.34 BISS-C.3
  Bottom 0.152: v56.01,57.68 54.94,58.75 53.8,58.75 IC4.6
SCK1  (via drill 0.35)
  Top 0.152: v12.72,28.5 16.54,28.5 17.07,27.96 U1.63
  Route15 0.152: v12.72,28.5 12.72,28.04 8.76,24.08 6.55,24.08 4.8,22.33 4.8,8.99 7.7,6.1 16.76,6.1 GLCD.3
SCK2  (via drill 0.35)
  Top 0.152: v24.16,14.63 23.62,15.16 23.62,15.85 U1.31
  Route15 0.152: v24.16,14.63 32.99,14.63 34.78,12.84 v34.52,12.57 34.82,12.8 36.27,11.35 37.34,11.35 38.63,12.65 46.94,12.65 TP2.TP
  Bottom 0.152: v34.52,12.57 34.9,12.19 34.9,11.28 U2.6 34.9,11.2 36.12,9.98 36.73,9.98 38.18,11.43 R13.2
SCK3  (via drill 0.35)
  Top 0.152: U1.58 19.58,27.28 19.58,29.03 26.36,35.81 42.52,35.81 v42.52,36.12 | v84.43,34.21 85.27,33.38 85.27,33.15 AC1.8
  Route2 0.152: v55.02,21.11 51.74,24.38 51.74,24.84 50.98,25.6 50.98,26.21 42.52,34.67 v42.52,36.12 | v84.43,34.21 84.35,34.14 84.35,33.91 84.96,33.3 92.89,33.3 94.41,31.77 95.25,31.77 TP14.TP
  Route15 0.152: v84.43,34.21 81.15,34.21 68.05,21.11 v55.02,21.11
SDI1  (via drill 0.35)
  Top 0.152: v24.31,13.72 25.98,15.39 25.98,17.83 U1.33 | GLCD.1 v14.78,7.16
  Route15 0.152: v24.31,13.72 23.93,13.72 23.39,13.18 21.18,13.18 19.96,11.96 19.58,11.96 v14.78,7.16
SDI2  (via drill 0.35)
  Top 0.152: v25.3,15.85 24.08,15.85 U1.32
  Route2 0.152: v33.38,15.39 33.53,15.24 33.6,15.24 36.12,12.72 36.12,11.58 38.94,8.76 v40.31,8.76
  Route15 0.152: v25.3,15.85 32.23,15.85 33.03,15.05 v33.38,15.39 | v40.31,8.76 46.86,8.76 TP4.TP
  Bottom 0.152: 33.68,16.15 33.68,16.61 U2.2 33.68,16.15 | 33.68,16.15 33.68,15.7 v33.38,15.39 | v40.31,8.76 39.85,8.31 39.85,7.62 R11.2
SDI3  (via drill 0.35)
  Top 0.152: v85.42,24.23 86.26,25.07 86.26,25.22 AC1.6 86.26,24.99 88.39,22.86 TP20.TP | v19.89,11.35 19.89,12.8 19.28,13.41 19.28,14.02 19.58,14.33 19.58,15.85 U1.23
  Route15 0.152: v85.42,24.23 85.42,17.91 71.25,3.73 63.4,3.73 61.95,5.18 61.95,5.56 61.42,6.1 60.5,6.1 59.74,5.33 59.74,4.5 56.77,1.52 32.61,1.52 28.96,5.18 28.96,5.49 23.09,11.35 v19.89,11.35
SDO1  (via drill 0.35)
  Top 0.152: v24.77,27.81 24.38,28.19 23.85,28.19 23.62,27.96 23.62,27.28 U1.50
  Route2 0.152: v24.77,27.81 24.77,22.33 16,13.56 16,6.17 15.24,5.41 GLCD.2
SDO2  (via drill 0.35)
  Top 0.152: v29.03,16.61 27.36,18.29 26.06,18.29 U1.34
  Route15 0.152: 37.03,16.61 46.86,16.61 46.94,16.54 TP1.TP | 37.03,16.61 v29.03,16.61 | 37.03,16.61 v37.03,11.96
  Bottom 0.152: U2.5 36.2,11.28 36.35,11.28 v37.03,11.96 37.26,11.96 39.24,13.95 39.78,13.95 R12.2
SDO3  (via drill 0.35)
  Top 0.152: v85.42,34.21 86.26,33.38 86.26,33.15 AC1.7 | v19.89,13.72 19.89,15.09 20.04,15.24 20.04,15.85 U1.24
  Route2 0.152: v23.32,12.19 21.79,13.72 v19.89,13.72 | v85.42,34.21 85.5,34.14 85.72,34.14 85.95,34.37 93.27,34.37 94.41,35.51 95.25,35.51 TP9.TP
  Route15 0.152: v85.42,34.21 85.42,26.14 75.06,15.77 75.06,10.44 69.57,4.95 69.57,4.65 68.96,4.04 65.61,4.04 64.54,5.11 64.54,5.49 63.63,6.4 60.35,6.4 59.44,5.49 59.44,4.65 56.62,1.83 40.23,1.83 29.87,12.19 v23.32,12.19
SL+  (via drill 0.35)
  Top 0.152: BISS-C.8 100.65,73.34 100.65,69.85 R14.2
  Route15 0.152: v54.41,62.79 54.94,62.79 67.89,75.74 98.22,75.74 100.28,73.69 BISS-C.8
  Bottom 0.152: v54.41,62.79 53.8,62.18 53.8,62.03 IC4.1
SL-  (via drill 0.35)
  Top 0.152: BISS-C.9 102.55,73.34 102.55,69.85 R14.1
  Route15 0.152: v55.78,62.71 64.24,62.71 76.81,75.29 97.61,75.29 99.29,73.61 99.29,73.23 99.9,72.62 101.88,72.62 102.87,73.61 BISS-C.9
  Bottom 0.152: v55.78,62.71 54.41,61.34 53.8,61.34 IC4.2
SRAM_CS  (via drill 0.35)
  Top 0.152: v23.09,13.79 22.25,13.79 21.87,14.17 21.87,14.78 22.02,14.94 22.02,15.85 U1.28
  Route15 0.152: v23.09,13.79 23.09,14.55 26.36,17.83 31.55,17.83 | 31.55,17.83 44.5,17.83 TP5.TP | 31.55,17.83 v31.55,17.37
  Bottom 0.152: v31.55,17.37 32.16,16.76 32.38,16.76 U2.1
SW1  (via drill 0.35)
  Top 0.152: v20.57,28.5 U1.56 | v56.31,2.44 86.18,2.44 95.1,11.35 95.1,18.21 107.17,30.29 | 107.17,30.29 107.21,30.33 109.19,30.33 SW1.2 | 107.17,30.29 104.17,33.3 104.17,34.29 EXT_SW.1
  Route15 0.152: v20.57,28.5 21.72,28.5 22.33,29.11 34.98,29.11 41.53,22.55 47.02,22.55 52.35,17.22 52.35,6.4 v56.31,2.44
  Bottom 0.152: C33.1 109.35,30.48 109.27,30.4 SW1.2
SW2  (via drill 0.35)
  Top 0.152: v50.75,40.92 48.23,40.92 42.82,35.51 26.52,35.51 19.96,28.96 19.96,28.19 20.04,28.12 20.04,27.28 U1.57
  Route2 0.152: v75.44,37.64 v73.15,39.93
  Route15 0.152: v50.75,40.92 51.05,40.92 52.27,39.7 61.8,39.7 63.7,41.6 66.37,41.6 68.58,39.4 72.62,39.4 v73.15,39.93 | v75.44,37.64 86.72,37.64 86.72,37.26 98.18,25.79 | 98.18,25.79 107.52,16.46 109.19,16.46 SW2.2 | 98.18,25.79 EXT_SW.2
  Bottom 0.152: C34.1 113.39,16.46 109.35,16.46 109.27,16.38 SW2.2
TEST_P1  (via drill 0.35)
  Top 0.152: v13.34,22.71 13.41,22.78 14.63,22.78 U1.6 | TEST_P1.TP 99.06,67.36 103.25,67.36 104.7,68.81 112.01,68.81 113,69.8 PWM.10
  Route2 0.152: v13.34,22.71 13.34,26.98 v10.44,29.87
  Route15 0.152: v10.44,29.87 10.44,33.91 36.65,60.12 65,60.12 76.66,71.78 111.1,71.78 PWM.10
TXDE  (via drill 0.35)
  Top 0.152: v27.2,22.33 26.06,22.33 U1.42
  Route15 0.152: U1_TTL.4 11.43,8.84 10.44,7.85 8.46,7.85 7.85,8.46 7.85,9.3 11.12,12.57 19.66,12.57 27.2,20.12 v27.2,22.33
U1RX  (via drill 0.35)
  Top 0.152: v22.02,12.57 22.78,12.57 23.7,13.49 23.7,14.1 23.09,14.71 23.09,15.85 U1.30
  Route2 0.152: v19.89,10.44 v22.02,12.57
  Route15 0.152: v19.89,10.44 18.97,10.44 15.09,6.55 8.69,6.55 U1_TTL.2
U1TX  (via drill 0.35)
  Top 0.152: v22.48,14.48 22.55,14.55 22.55,15.85 U1.29
  Route15 0.152: v22.48,14.48 22.02,14.48 19.81,12.27 12.27,12.27 U1_TTL.3
VDD  (via drill 0.35)
  Top 0.203: U1.26 21.07,12.86 21.07,12.22 21.07,11.95 21.11,11.89 21.57,11.43 21.57,9.75 C8.2 21.64,9.68 23.32,9.68 27.89,5.11 GLCD.7 27.96,5.11 28.27,5.11 39.09,15.93 40.23,15.93 40.77,16.46 | U1.40 26.98,21.34 27.89,21.34 27.94,21.34 28.35,21.34 28.42,21.34 29.26,21.34 30.4,21.34 31.09,21.34 31.43,21.34 31.7,21.34 32.23,21.34 32.31,21.34 32.69,21.34 33.18,21.34 | 33.18,21.34 33.19,21.34 | U1.60 18.57,28.19 18.57,28.57 18.57,28.88 18.57,29.18 18.57,29.49 18.57,30 18.57,30.56 18.57,30.96 18.57,31.01 18.57,31.17 | 18.57,31.17 18.57,31.24 18.57,31.27 | 14.61,23.39 13.34,23.39 12.7,23.39 10.06,23.39 8.73,23.39 8.69,23.39 7.77,23.39 7.7,23.32 C2.1 7.62,23.24 7.09,22.71 v6.55,22.71 | 14.61,23.39 14.63,23.39 | 89.42,34.4 87.4,32.38 84.89,32.38 84.35,32.92 84.35,33.07 AC1.9 84.28,33.22 84.28,33.38 83.74,33.91 73.3,33.91 73.23,33.91 72.39,33.07 TP10.TP TP13.TP 72.47,27.89 72.47,20.42 72.47,20.34 | 89.42,34.4 91.44,32.38 91.44,31.17 90.6,30.33 90.6,29.26 C23.1 | SJ1.1 92.43,38.1 91.14,36.8 | IC1.4 85.09,12.52 85.09,10.16 85.11,10.13 85.11,9.37 IC1.2 85.04,9.22 84.73,8.91 v84.73,6.4 | 72.47,20.34 78.72,20.34 78.72,20.27 78.74,20.27 | 72.47,20.34 72.39,20.34 TP15.TP | 91.14,36.8 91.14,36.73 90.6,36.2 90.6,35.59 C24.2 90.53,35.51 89.42,34.4 | v91.06,36.8 91.14,36.8 | AC1.4 84.28,25.22 84.28,25.07 83.29,24.08 81.28,24.08 81.28,23.28 81.23,23.24 80.85,22.86 C26.1 80.85,22.78 80.85,21.41 79.78,20.34 79.78,20.32 | U1.19 17.53,15.85 17.46,15.81 17.46,15.06 16.38,13.97 16.46,13.95 16.46,12.72 17.53,11.66 17.57,11.58 17.57,11.27 17.6,11.2 17.6,9.91 17.75,9.75 C7.2 17.83,9.75 v19.28,9.75
  Top 0.203: 14.63,23.39 U1.5 | 14.63,23.39 14.61,23.39 | C12.2 35.97,21.57 v34.82,21.57 33.38,21.57 33.22,21.41 33.18,21.34 | C19.2 39.32,18.75 38.86,18.75 36.04,21.57 C12.2 | v20.12,34.75 19.05,34.75 C10.2 18.97,34.67 18.97,31.7 18.59,31.32 18.59,31.17 18.57,31.17 | v25.98,26.59 25.98,25.38 U1.48 | v29.18,29.72 30.25,30.79 45.72,30.79 R3.2 | 40.77,16.46 40.77,19.96 38.33,22.4 36.88,22.4 36.12,21.64 C12.2 | ICSP.2 60.96,5.11 60.66,5.11 54.86,10.9 46.41,10.9 40.84,16.46 40.77,16.46 | AVDD_JUMPER.3 5.33,35.81 6.17,34.98 6.17,29.03 5.41,28.27 v5.41,21.57
  Route2 0.203: v6.55,22.71 v5.41,21.57 | 25.98,28.88 v25.98,26.59 | v20.12,34.75 25.98,28.88 | v29.18,29.72 28.35,28.88 25.98,28.88
  Route15 0.203: v84.73,6.4 81.69,3.35 63.25,3.35 61.57,5.03 60.96,5.03 ICSP.2 | v19.28,9.75 22.55,9.75 22.78,9.53 23.47,9.53 27.89,5.11 GLCD.7 | v34.82,21.57 32.69,21.57 27.66,26.59 v25.98,26.59 | v6.55,22.71 8.38,22.71 20.12,34.44 v20.12,34.75
  Bottom 0.203: v91.06,36.8 89.92,36.8 C25.2 | v84.73,6.4 84.73,5.11 C18.1 | C7.2 17.83,9.75 v19.28,9.75 21.57,9.75 C8.2 | U2.8 32.38,11.28 30.18,11.28 C14.1 30.1,11.43 30.1,8.91 C15.2 30.02,8.84 30.02,8.15 27.96,6.1 27.96,5.11 GLCD.7 27.96,5.03 28.19,4.8 28.19,2.59 C20.1 | v6.55,22.71 6.02,23.24 5.11,23.24 C11.2 | Y1.1 39.09,18.36 39.09,19.74 Y1.4 | Y1.4 38.94,19.74 38.56,20.12 38.56,20.19 37.95,20.8 37.03,20.8 36.27,21.57 36.04,21.57 C12.2 35.89,21.57 v34.82,21.57 | C13.1 40.39,19.05 39.85,19.58 39.17,19.58 Y1.4 | v20.12,34.75 19.05,34.75 C10.2 | v25.98,26.59 31.09,31.7 32,31.7 R2.2
  pour Top (no thermals): 78.74,20.32 91.44,20.32 91.44,11.43 78.74,11.43
VIN  (via drill 0.35)
  Top 0.203: 87.33,8.08 87.33,9.3 IC1.3 87.48,9.3 89.84,9.3 91.82,11.28 91.82,15.47 97.99,21.64 97.99,38.1 SJ1.3 98.07,38.18 98.83,38.18 111.25,50.6 113.77,50.6 114.83,51.66 114.83,70.26 111.48,73.61 105.46,73.61 BISS-C.10 | 87.33,8.08 84.35,5.11 77.5,5.11 TP7.TP | v89.23,6.4 89.08,6.4 87.4,8.08 87.33,8.08 | FUSE.1 96.77,12.65 v95.71,11.58 95.71,11.43 86.03,1.75 13.79,1.75 7.85,7.7 7.85,9.6 2.44,15.01 2.44,26.82 3.81,28.19 3.81,28.88 IC3.1 3.81,28.96 3.28,29.49 v3.28,33.38
  Route15 0.203: v95.71,11.58 94.41,11.58 v89.23,6.4 | v43.28,61.34 38.56,61.34 36.8,63.09 34.59,63.09 15.54,44.04 13.95,44.04 v3.28,33.38
  Bottom 0.203: v89.23,6.4 89.84,5.79 89.84,5.11 C17.1 | v3.28,33.38 4.19,34.29 C27.1 | 49.99,65.84 49.99,64.85 C30.1 49.91,64.77 49.91,64.16 48.08,62.33 48.08,62.1 47.93,61.95 IC4.16 47.78,62.03 46.79,62.03 46.02,61.27 43.28,61.27 | 49.99,65.84 49.99,68.58 C31.1 49.91,68.66 49.91,71.09 C32.1 | 43.28,61.27 41.91,61.27 BISS_DE2.1 | BISS_DE1.3 53.8,65.84 49.99,65.84 | v43.28,61.34 43.28,61.27 | v95.71,11.58 95.71,11.81 94.03,13.49 94.03,14.25 D1.C
VIN_PWR
  Top 0.305: FUSE.2 98.68,12.72 98.68,18.21 97.84,19.05 TP8.TP | VIN_5+.2 96.55,6.4 96.55,10.44 98.68,12.57 FUSE.2 | USBC-PWR.4 110.49,6.4 110.19,6.4 104.01,12.57 98.83,12.57 FUSE.2
VSS  (via drill 0.35)
  Top 0.203: U1.47 25.4,24.84 | 25.4,24.84 24.13,24.84 23.42,24.84 23.42,24.69 v22.86,24.13 | 16.51,23.84 17.78,23.84 18.76,23.84 19.07,24.15 U1.59 | 16.51,23.84 U1.4 12.72,23.84 10.45,23.84 10.36,23.85 9.3,24.92 8.31,24.92 | 17.63,19.05 17.07,18.49 U1.18 16.99,15.85 16.99,15.09 16.23,14.33 15.09,14.33 14.86,14.1 14.86,11.12 17.83,8.15 C7.1 17.83,8.08 20.57,8.08 | v20.32,21.59 19.57,20.84 U1.10 10.91,20.84 | 16.51,23.84 16.8,24.13 v17.78,24.13 | 26.67,24.84 25.4,24.84 | v77.47,22.86 C26.2 | 20.57,8.08 21.57,8.08 C8.1 | AC1.11 82.3,33.15 81.38,33.15 AC1.12 81.23,33.15 79.86,33.15 78.56,31.85 78.56,26.59 79.86,25.3 81.23,25.3 AC1.1 81.38,25.22 81.38,24.99 81.92,24.46 82.68,24.46 83.29,25.07 83.29,25.22 AC1.3 83.36,25.3 83.36,25.53 83.9,26.06 86.72,26.06 86.79,26.06 86.94,25.91 91.29,25.91 92.05,26.67 C22.2 92.28,26.67 v92.28,27.96 92.28,29.11 C23.2 92.28,29.18 92.28,29.26 92.28,31.7 C21.2 92.28,31.85 92.28,35.51 92.28,35.59 C24.1 | C10.1 19.05,36.42 27.81,36.42 28.19,36.8 R10.1 28.35,36.88 28.35,41.07 29.79,42.52 J4.3 | C12.1 37.72,21.57 38.33,21.57 40.39,19.51 40.39,17.83 39.4,16.84 C19.1 39.32,16.92 38.33,16.92 34.44,20.8 26.06,20.8 U1.39 23.38,20.84 22.86,20.32 v22.86,19.05 20.82,19.05 20.57,18.8 U1.25 20.57,15.85 20.57,10.64 20.57,10.59 20.57,8.08 | POWER.C 45.72,36.35 v47.02,36.35 48.23,36.35 LED2.C 48.31,36.35 50.75,36.35 LED3.C 50.83,36.35 53.34,36.35 LED4.C | C3.2 4.27,17.75 4.27,16.08 7.62,12.72 TP16.TP | 8.31,24.92 7.62,24.92 C2.2 | v83.82,9.3 82.83,9.3 IC1.1 | R8.1 7.92,36.8 7.92,32.08 7.62,31.77 TP17.TP 7.62,27.94 7.29,27.61 | R7.1 8,55.93 8,60.05 9.53,61.57 J1.3
  Top 0.203: R9.1 28.27,55.93 28.27,60.05 29.79,61.57 J3.3 | 7.29,27.61 8.31,26.59 8.31,24.92 | 7.29,27.61 7.01,27.89 6.33,27.89 IC3.3
  other vias: 17.78,19.05
  pour Route2 (no thermals): 2.54,74.93 116.84,74.93 116.84,1.27 2.54,1.27
  pour Bottom (no thermals): 1.27,76.2 118.11,76.2 118.11,0 1.27,0
  pour Top: 16.51,25.4 24.13,25.4 24.13,17.78 16.51,17.78

## Text on the board
Top: PIC32AK FE 1.1
Bottom: 1